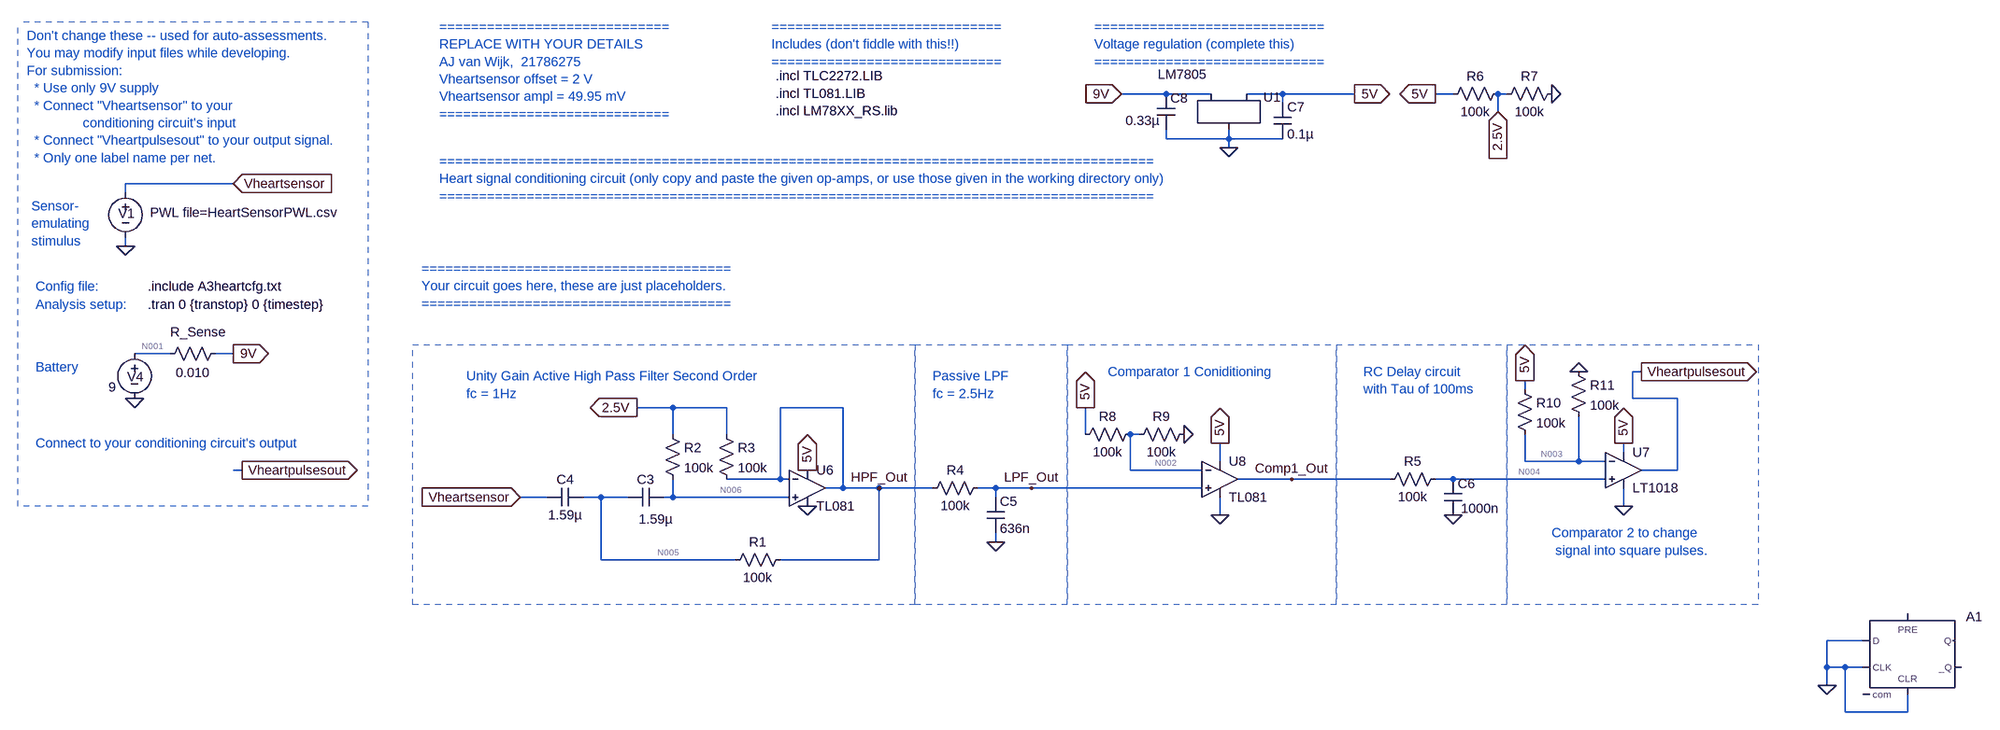
[diagram p0: schematic E344_A3_heart.asc]
E344_A3_heart.asc, the LTspice schematic file:
Version 4
SHEET 1 1824 680
WIRE -256 -1280 -336 -1280
WIRE -176 -1280 -256 -1280
WIRE -48 -1280 -112 -1280
WIRE 80 -1280 -48 -1280
WIRE 256 -1280 224 -1280
WIRE 352 -1280 336 -1280
WIRE -48 -1264 -48 -1280
WIRE 336 -1248 336 -1280
WIRE -256 -1200 -256 -1216
WIRE -144 -1200 -144 -1216
WIRE -144 -1200 -256 -1200
WIRE -48 -1200 -144 -1200
WIRE -144 -1184 -144 -1200
WIRE -1920 -1120 -2112 -1120
WIRE -2112 -1104 -2112 -1120
WIRE -2112 -1008 -2112 -1024
WIRE -2032 -816 -2096 -816
WIRE -1920 -816 -1952 -816
WIRE 592 -784 576 -784
WIRE 384 -752 384 -768
WIRE 576 -736 576 -784
WIRE 656 -736 576 -736
WIRE -1136 -720 -1200 -720
WIRE -1040 -720 -1136 -720
WIRE -832 -720 -944 -720
WIRE -1136 -672 -1136 -720
WIRE -1040 -672 -1040 -720
WIRE -400 -672 -400 -720
WIRE -304 -672 -320 -672
WIRE 560 -640 560 -656
WIRE -160 -624 -160 -656
WIRE 384 -624 384 -672
WIRE 480 -624 480 -704
WIRE 480 -624 384 -624
WIRE 528 -624 480 -624
WIRE -1904 -608 -1920 -608
WIRE -320 -608 -320 -672
WIRE -192 -608 -320 -608
WIRE 656 -608 656 -736
WIRE 656 -608 592 -608
WIRE -944 -592 -944 -720
WIRE -944 -592 -1040 -592
WIRE -928 -592 -944 -592
WIRE -32 -592 -128 -592
WIRE 144 -592 -32 -592
WIRE 256 -592 224 -592
WIRE 528 -592 256 -592
WIRE -832 -576 -832 -720
WIRE -832 -576 -864 -576
WIRE -768 -576 -832 -576
WIRE -672 -576 -768 -576
WIRE -560 -576 -592 -576
WIRE -496 -576 -560 -576
WIRE -192 -576 -496 -576
WIRE -1360 -560 -1408 -560
WIRE -1264 -560 -1296 -560
WIRE -1216 -560 -1264 -560
WIRE -1136 -560 -1136 -592
WIRE -1136 -560 -1152 -560
WIRE -928 -560 -1136 -560
WIRE -560 -560 -560 -576
WIRE 560 -544 560 -576
WIRE -160 -528 -160 -560
WIRE -560 -480 -560 -496
WIRE -1264 -448 -1264 -560
WIRE -1024 -448 -1264 -448
WIRE -768 -448 -768 -576
WIRE -768 -448 -944 -448
WIRE 1152 -304 1088 -304
WIRE 1088 -256 1088 -304
WIRE 1120 -256 1088 -256
WIRE 1152 -256 1120 -256
WIRE 1088 -224 1088 -256
WIRE 1120 -176 1120 -256
WIRE 1232 -176 1232 -208
WIRE 1232 -176 1120 -176
FLAG -2112 -1008 0
FLAG -1920 -1120 Vheartsensor
IOPIN -1920 -1120 In
FLAG -1920 -816 9V
IOPIN -1920 -816 Out
FLAG -2096 -736 0
FLAG -336 -1280 9V
IOPIN -336 -1280 In
FLAG -144 -1184 0
FLAG 80 -1280 5V
IOPIN 80 -1280 Out
FLAG -1904 -608 Vheartpulsesout
IOPIN -1904 -608 Out
FLAG 1088 -224 0
FLAG -896 -608 5V
IOPIN -896 -608 Out
FLAG -896 -544 0
FLAG -560 -480 0
FLAG -160 -528 0
FLAG 256 -528 0
FLAG 560 -544 0
FLAG -160 -656 5V
IOPIN -160 -656 Out
FLAG 560 -656 5V
IOPIN 560 -656 Out
FLAG 432 -1280 0
FLAG 224 -1280 5V
IOPIN 224 -1280 Out
FLAG 336 -1248 2.5V
IOPIN 336 -1248 In
FLAG -1200 -720 2.5V
IOPIN -1200 -720 Out
FLAG -224 -672 0
FLAG -400 -720 5V
IOPIN -400 -720 Out
FLAG 384 -768 5V
IOPIN 384 -768 Out
FLAG 480 -784 0
FLAG -496 -576 LPF_Out
FLAG -32 -592 Comp1_Out
FLAG -768 -576 HPF_Out
FLAG 592 -784 Vheartpulsesout
IOPIN 592 -784 Out
FLAG -1408 -560 Vheartsensor
IOPIN -1408 -560 In
SYMBOL voltage -2112 -1120 R0
WINDOW 123 0 0 Left 0
WINDOW 39 0 0 Left 0
WINDOW 3 44 52 Left 2
WINDOW 0 -13 54 Left 2
SYMATTR Value PWL file=HeartSensorPWL.csv
SYMATTR InstName V1
SYMBOL voltage -2096 -832 R0
WINDOW 123 24 44 Left 2
WINDOW 39 0 0 Left 0
WINDOW 3 -46 76 Left 2
WINDOW 0 -13 57 Left 2
SYMATTR Value 9
SYMATTR InstName V4
SYMBOL res -1936 -832 R90
WINDOW 0 -7 47 VBottom 2
WINDOW 3 34 56 VTop 2
SYMATTR InstName R_Sense
SYMATTR Value 0.010
SYMBOL LM7805 -144 -1264 R0
WINDOW 3 -83 -66 Top 2
SYMATTR InstName U1
SYMBOL dflop 1232 -352 R0
SYMATTR InstName A1
SYMBOL cap -1152 -576 R90
WINDOW 0 0 32 VBottom 2
WINDOW 3 40 14 VTop 2
SYMATTR InstName C3
SYMATTR Value 1.59µ
SYMBOL res -928 -464 R90
WINDOW 0 0 56 VBottom 2
WINDOW 3 32 56 VTop 2
SYMATTR InstName R1
SYMATTR Value 100k
SYMBOL cap -1296 -576 R90
WINDOW 0 0 32 VBottom 2
WINDOW 3 32 32 VTop 2
SYMATTR InstName C4
SYMATTR Value 1.59µ
SYMBOL res -1152 -688 R0
SYMATTR InstName R2
SYMATTR Value 100k
SYMBOL res -1056 -688 R0
SYMATTR InstName R3
SYMATTR Value 100k
SYMBOL res -576 -592 R90
WINDOW 0 0 56 VBottom 2
WINDOW 3 32 56 VTop 2
SYMATTR InstName R4
SYMATTR Value 100k
SYMBOL cap -576 -560 R0
SYMATTR InstName C5
SYMATTR Value 636n
SYMBOL cap 240 -592 R0
WINDOW 3 30 52 Left 2
SYMATTR Value 1000n
SYMATTR InstName C6
SYMBOL res 240 -608 R90
WINDOW 0 0 56 VBottom 2
WINDOW 3 32 56 VTop 2
SYMATTR InstName R5
SYMATTR Value 100k
SYMBOL res 240 -1264 R270
WINDOW 0 32 56 VTop 2
WINDOW 3 0 56 VBottom 2
SYMATTR InstName R6
SYMATTR Value 100k
SYMBOL res 336 -1264 R270
WINDOW 0 32 56 VTop 2
WINDOW 3 0 56 VBottom 2
SYMATTR InstName R7
SYMATTR Value 100k
SYMBOL res -416 -656 R270
WINDOW 0 32 56 VTop 2
WINDOW 3 0 56 VBottom 2
SYMATTR InstName R8
SYMATTR Value 100k
SYMBOL res -320 -656 R270
WINDOW 0 32 56 VTop 2
WINDOW 3 0 56 VBottom 2
SYMATTR InstName R9
SYMATTR Value 100k
SYMBOL res 368 -768 R0
SYMATTR InstName R10
SYMATTR Value 100k
SYMBOL res 464 -800 R0
SYMATTR InstName R11
SYMATTR Value 100k
SYMBOL cap -64 -1264 R0
SYMATTR InstName C7
SYMATTR Value 0.1µ
SYMBOL cap -272 -1280 R0
WINDOW 3 -56 48 Left 2
SYMATTR Value 0.33µ
SYMATTR InstName C8
SYMBOL opamp2 -896 -640 R0
SYMATTR InstName U6
SYMATTR Value TL081
SYMATTR SpiceModel TL081
SYMBOL opamp2 -160 -656 R0
SYMATTR InstName U8
SYMATTR Value TL081
SYMATTR SpiceModel TL081
SYMBOL LT1018 560 -608 R0
SYMATTR InstName U7
TEXT -2072 -904 Left 2 !.tran 0 {transtop} 0 {timestep}
TEXT -2072 -936 Left 2 !.include A3heartcfg.txt
TEXT -2288 -1384 Left 2 ;Don't change these -- used for auto-assessments.\nYou may modify input files while developing.\nFor submission: \n  * Use only 9V supply \n  * Connect "Vheartsensor" to your \n               conditioning circuit's input\n  * Connect "Vheartpulsesout" to your output signal.\n  * Only one label name per net.
TEXT -2272 -936 Left 2 ;Config file:
TEXT -2272 -904 Left 2 ;Analysis setup:
TEXT -2272 -792 Left 2 ;Battery
TEXT -2280 -1080 Left 2 ;Sensor-\nemulating \nstimulus
TEXT -1552 -1400 Left 2 ;=============================\nREPLACE WITH YOUR DETAILS\nAJ van Wijk,  21786275\nVheartsensor offset = 2 V\nVheartsensor ampl = 49.95 mV\n=============================
TEXT -1552 -1160 Left 2 ;==========================================================================================\nHeart signal conditioning circuit (only copy and paste the given op-amps, or use those given in the working directory only)\n==========================================================================================
TEXT -384 -1400 Left 2 ;=============================\nVoltage regulation (complete this)\n=============================
TEXT -952 -1312 Left 2 !.incl TLC2272.LIB\n.incl TL081.LIB\n.incl LM78XX_RS.lib
TEXT -2272 -656 Left 2 ;Connect to your conditioning circuit's output
TEXT -960 -1400 Left 2 ;=============================\nIncludes (don't fiddle with this!!)\n=============================
TEXT -1584 -968 Left 2 ;=======================================\nYour circuit goes here, these are just placeholders.\n=======================================
TEXT -1504 -776 Left 2 ;Unity Gain Active High Pass Filter Second Order\nfc = 1Hz
TEXT -360 -784 Left 2 ;Comparator 1 Coniditioning
TEXT -672 -776 Left 2 ;Passive LPF\nfc = 2.5Hz
TEXT 96 -784 Left 2 ;RC Delay circuit\nwith Tau of 100ms
TEXT 432 -496 Left 2 ;Comparator 2 to change\n signal into square pulses.
LINE Normal -2304 -544 -2304 -1408 1
LINE Normal -1680 -1408 -1680 -544 1
LINE Normal -1680 -544 -2304 -544 1
LINE Normal -1680 -1408 -2304 -1408 1
RECTANGLE Normal -704 -368 -1600 -832 2
RECTANGLE Normal -432 -368 -704 -832 2
RECTANGLE Normal 48 -368 -432 -832 2
RECTANGLE Normal 352 -368 48 -832 2
RECTANGLE Normal 800 -368 352 -832 2

The netlist it stands for:
* E344_A3_heart.asc
V1 Vheartsensor 0 PWL file=HeartSensorPWL.csv
V4 N001 0 9
R_Sense 9V N001 0.010
XU1 9V 0 5V LM7805
A1 0 0 0 0 0 0 0 0 DFLOP
C3 N006 N005 1.59µ
R1 HPF_Out N005 100k
C4 N005 Vheartsensor 1.59µ
R2 2.5V N006 100k
R3 2.5V HPF_Out 100k
R4 LPF_Out HPF_Out 100k
C5 LPF_Out 0 636n
C6 N004 0 1000n
R5 N004 Comp1_Out 100k
R6 5V 2.5V 100k
R7 2.5V 0 100k
R8 5V N002 100k
R9 N002 0 100k
R10 5V N003 100k
R11 0 N003 100k
C7 5V 0 0.1µ
C8 9V 0 0.33µ
XU6 N006 HPF_Out 5V 0 HPF_Out TL081 TL081  ; pins In+ In- V+ V- OUT
XU8 LPF_Out N002 5V 0 Comp1_Out TL081 TL081  ; pins In+ In- V+ V- OUT
XU7 N004 N003 5V 0 Vheartpulsesout LT1018  ; pins In+ In- V+ V- OUT
.tran 0 {transtop} 0 {timestep}
.include A3heartcfg.txt
* Don't change these -- used for auto-assessments.
* You may modify input files while developing.
* For submission:
*   * Use only 9V supply
*   * Connect "Vheartsensor" to your
*                conditioning circuit's input
*   * Connect "Vheartpulsesout" to your output signal.
*   * Only one label name per net.
* Config file:
* Analysis setup:
* Battery
* Sensor-
* emulating
* stimulus
* =============================
* REPLACE WITH YOUR DETAILS
* AJ van Wijk,  21786275
* Vheartsensor offset = 2 V
* Vheartsensor ampl = 49.95 mV
* =============================
* ==========================================================================================
* Heart signal conditioning circuit (only copy and paste the given op-amps, or use those given in the working directory only)
* ==========================================================================================
* =============================
* Voltage regulation (complete this)
* =============================
.incl TLC2272.LIB
.incl TL081.LIB
.incl LM78XX_RS.lib
* Connect to your conditioning circuit's output
* =============================
* Includes (don't fiddle with this!!)
* =============================
* =======================================
* Your circuit goes here, these are just placeholders.
* =======================================
* Unity Gain Active High Pass Filter Second Order
* fc = 1Hz
* Comparator 1 Coniditioning
* Passive LPF
* fc = 2.5Hz
* RC Delay circuit
* with Tau of 100ms
* Comparator 2 to change
*  signal into square pulses.
.lib LTC1.lib
.backanno
.end

* Results of the author's LTspice run, read from the files saved beside the schematic
* Operating Point, zero values left out:
*   V(vheartsensor) = 2.016 V
*   V(n001) = 9 V
*   V(9v) = 9 V
*   V(5v) = 5.003 V
*   V(n006) = 2.501 V
*   V(n005) = 2.501 V
*   V(hpf_out) = 2.501 V
*   V(2.5v) = 2.501 V
*   V(lpf_out) = 2.501 V
*   V(n004) = 3.207 V
*   V(comp1_out) = 3.207 V
*   V(n002) = 2.501 V
*   V(n003) = 2.501 V
*   V(vheartpulsesout) = 4.964 V
*   I(R11) = -25.01 µA
*   I(R10) = 25.01 µA
*   I(R9) = 25.01 µA
*   I(R8) = 25.01 µA
*   I(R7) = 25.01 µA
*   I(R6) = 25.01 µA
*   I(R5) = -6.1 nA
*   I(R4) = -32.55 pA
*   I(R3) = -77.15 pA
*   I(R2) = 32.55 pA
*   I(R_sense) = -10.33 mA
*   I(V4) = -10.33 mA
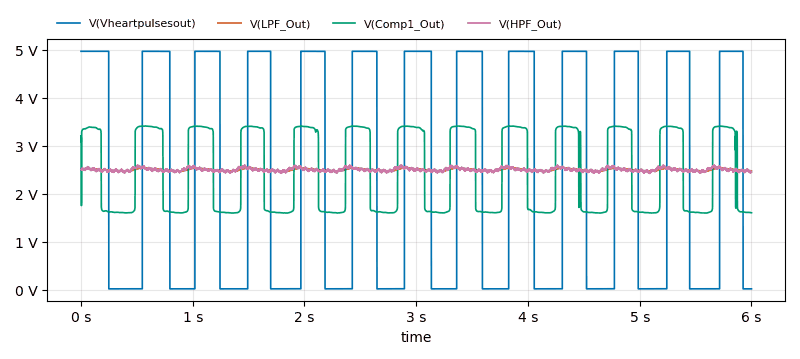
[diagram p1: Transient Analysis of E344_A3_heart.asc, plotted from the saved traces]
* Transient Analysis, 1 run:
*   V(Vheartpulsesout): min 21.93 mV, max 4.965 V, average 2.411 V, rms 3.451 V, last 21.95 mV
*   V(LPF_Out): min 2.468 V, max 2.542 V, average 2.501 V, rms 2.501 V, last 2.475 V
*   V(Comp1_Out): min 1.598 V, max 3.41 V, average 2.459 V, rms 2.611 V, last 1.605 V
*   V(HPF_Out): min 2.422 V, max 2.598 V, average 2.501 V, rms 2.501 V, last 2.448 V